# Altium schematic sheet 13-ESP32C6.SchDoc
size B; SheetNumber: 8; SheetTotal: 14
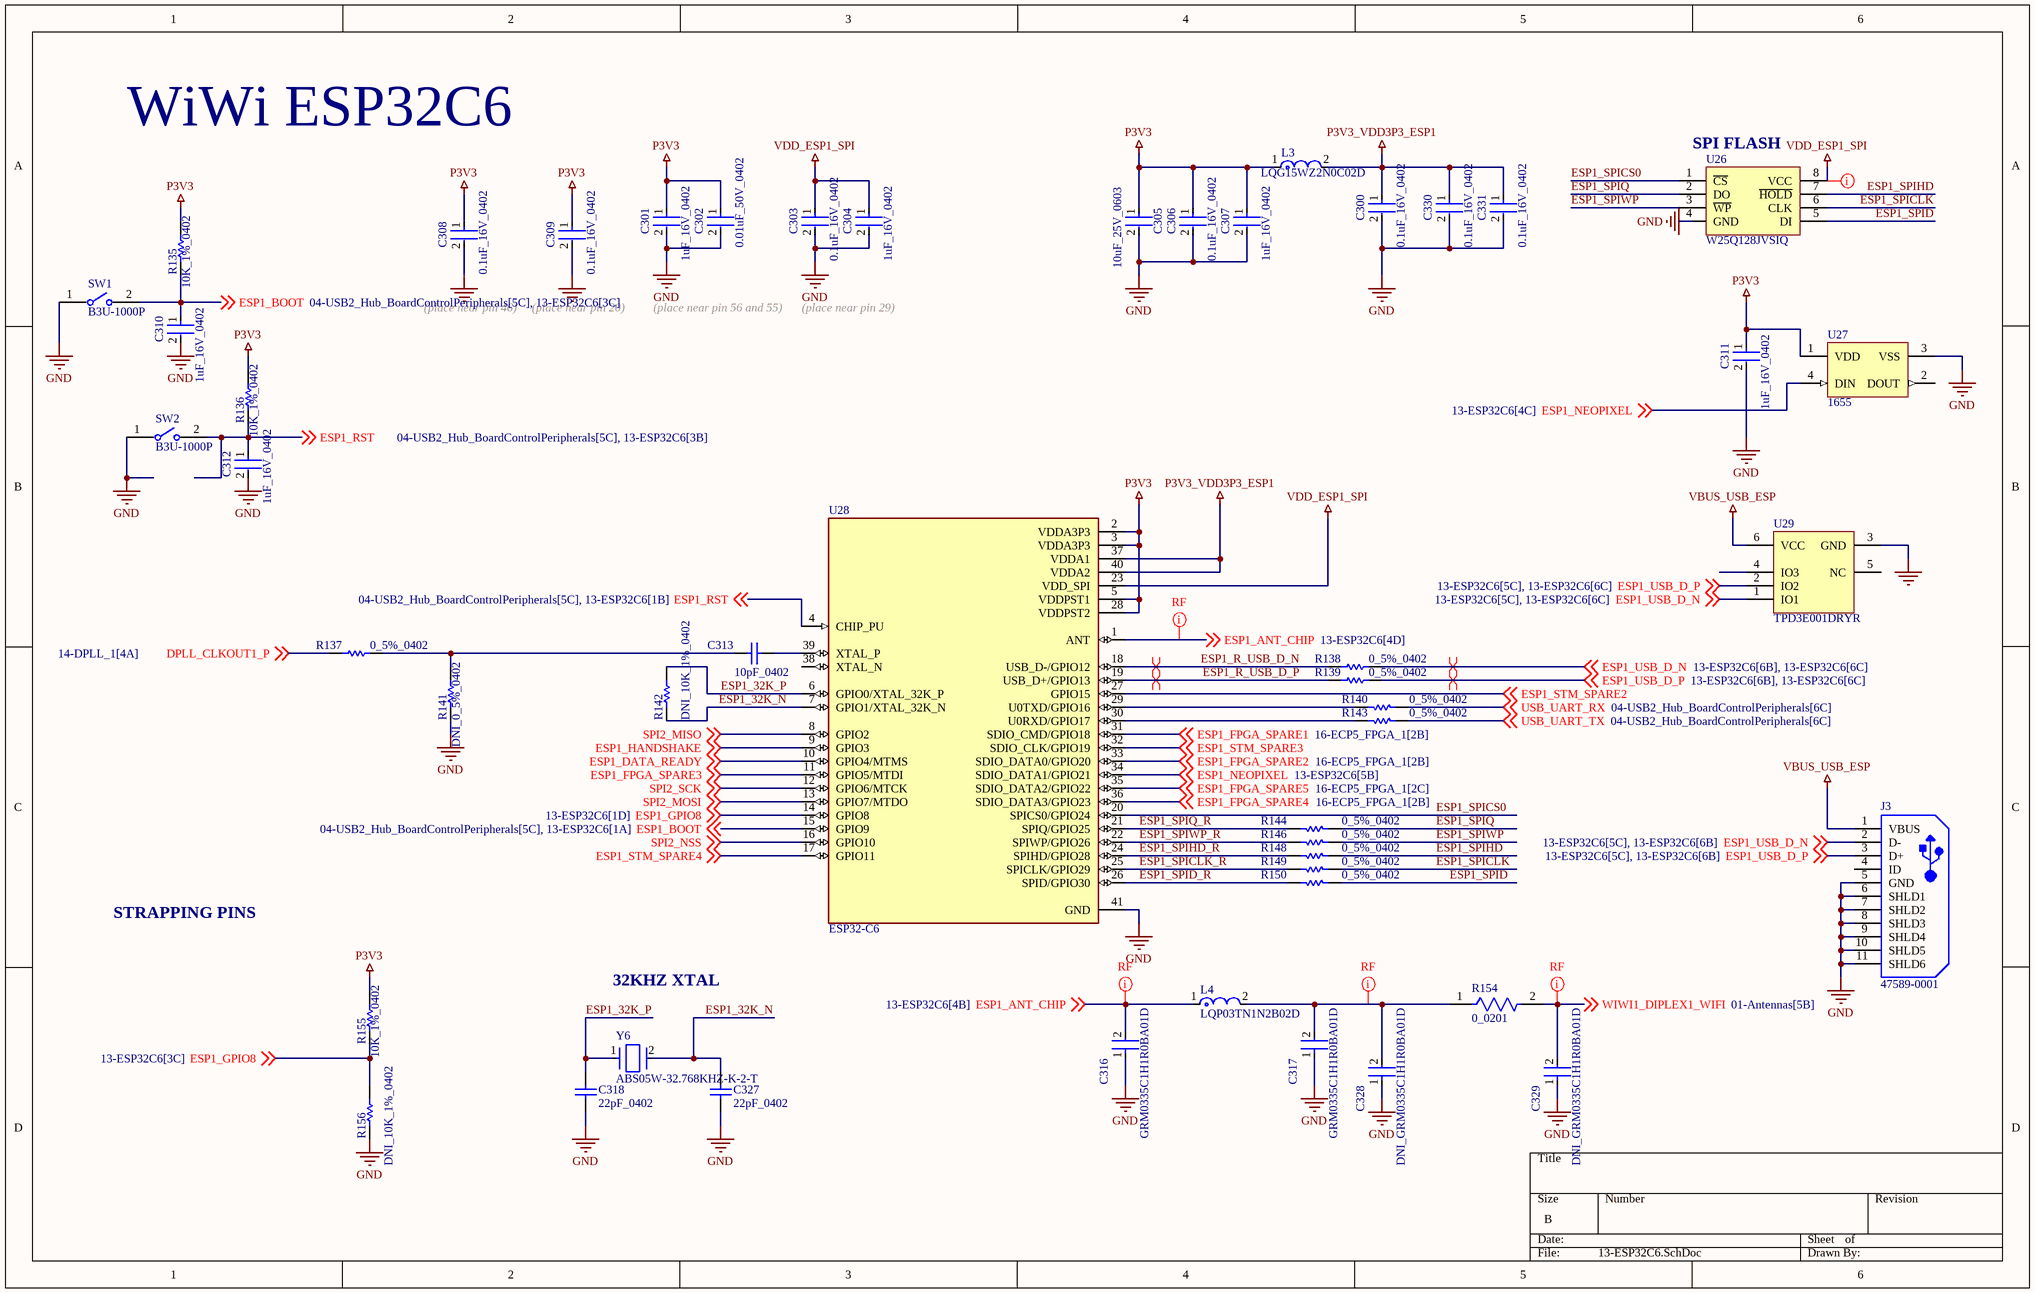
[diagram p0: 13-ESP32C6.SchDoc]

## Parts
C300  0.1uF_16V_0402  [FP-C0402-BB-MFG]
C301  1uF_16V_0402  [FP-0402-L_1_0_0_05-W_0_5-IPC_A]
C302  0.01uF_50V_0402  [FP-GCM155-0_05-IPC_C]
C303  0.1uF_16V_0402  [FP-C0402-BB-MFG]
C304  1uF_16V_0402  [FP-0402-L_1_0_0_05-W_0_5-IPC_A]
C305  10uF_25V_0603  [FP-CL10-IPC_C]
C306  0.1uF_16V_0402  [FP-C0402-BB-MFG]
C307  1uF_16V_0402  [FP-0402-L_1_0_0_05-W_0_5-IPC_A]
C308  0.1uF_16V_0402  [FP-C0402-BB-MFG]
C309  0.1uF_16V_0402  [FP-C0402-BB-MFG]
C310  1uF_16V_0402  [FP-0402-L_1_0_0_05-W_0_5-IPC_A]
C311  1uF_16V_0402  [FP-0402-L_1_0_0_05-W_0_5-IPC_A]
C312  1uF_16V_0402  [FP-0402-L_1_0_0_05-W_0_5-IPC_A]
C313  10pF_0402  [CAPC1005X55X25ML05T05]
C316  GRM0335C1H1R0BA01D  [FP-GRM033-0_03-IPC_C]
C317  GRM0335C1H1R0BA01D  [FP-GRM033-0_03-IPC_C]
C318  22pF_0402  [CAPC1005X55X25ML05T05]
C327  22pF_0402  [CAPC1005X55X25ML05T05]
C328  DNI_GRM0335C1H1R0BA01D  [FP-GRM033-0_03-IPC_C]  (no BOM)
C329  DNI_GRM0335C1H1R0BA01D  [FP-GRM033-0_03-IPC_C]  (no BOM)
C330  0.1uF_16V_0402  [FP-C0402-BB-MFG]
C331  0.1uF_16V_0402  [FP-C0402-BB-MFG]
J3  47589-0001  [MOLX-47589-0001_V]
L3  LQG15WZ2N0C02D  [FP-LQG15WH_02-IPC_B]
L4  LQP03TN1N2B02D  [FP-LQP03TG_02-IPC_A]
R135  10K_1%_0402  [RESC1005X40X25NL10T10]
R136  10K_1%_0402  [RESC1005X40X25NL10T10]
R137  0_5%_0402  [RESC1005X40X25NL05T10]
R138  0_5%_0402  [RESC1005X40X25NL05T10]
R139  0_5%_0402  [RESC1005X40X25NL05T10]
R140  0_5%_0402  [RESC1005X40X25NL05T10]
R141  DNI_0_5%_0402  [RESC1005X40X25NL05T10]  (no BOM)
R142  DNI_10K_1%_0402  [RESC1005X40X25NL10T10]  (no BOM)
R143  0_5%_0402  [RESC1005X40X25NL05T10]
R144  0_5%_0402  [RESC1005X40X25NL05T10]
R146  0_5%_0402  [RESC1005X40X25NL05T10]
R148  0_5%_0402  [RESC1005X40X25NL05T10]
R149  0_5%_0402  [RESC1005X40X25NL05T10]
R150  0_5%_0402  [RESC1005X40X25NL05T10]
R154  0_0201  [FP-RC_L0201-MFG]
R155  10K_1%_0402  [RESC1005X40X25NL10T10]
R156  DNI_10K_1%_0402  [RESC1005X40X25NL10T10]  (no BOM)
SW1  B3U-1000P  [FP-B3U-1000P-MFG]
SW2  B3U-1000P  [FP-B3U-1000P-MFG]
U26  W25Q128JVSIQ  [IC_W25Q128JVSIQ]
U27  1655  [ADA-RGB-1655_V]
U28  ESP32-C6  [QFN40P500X500X90-41N]
U29  TPD3E001DRYR  [DRY0006A]
Y6  ABS05W-32.768KHZ-K-2-T  [FP-ABS05W-MFG]

## Nets
GND: C300.2 C301.2 C302.2 C303.2 C304.2 C305.2 C306.2 C307.2 C308.2 C309.2 C310.2 C311.2 C312.2 C316.1 C317.1 C318.1 C327.1 C328.1 C329.1 C330.2 C331.2 J3.5(GND) J3.6(SHLD1) J3.7(SHLD2) J3.8(SHLD3) J3.9(SHLD4) J3.10(SHLD5) J3.11(SHLD6) R141.1 R156.1 SW1.1 SW2.1 U26.4(GND) U27.3(VSS) U28.41(GND) U29.3(GND)
P3V3: C301.1 C302.1 C305.1 C306.1 C307.1 C308.1 C309.1 C311.1 L3.1 R135.2 R136.2 R155.2 U27.1(VDD) U28.2(VDDA3P3) U28.3(VDDA3P3) U28.5(VDDPST1) U28.28(VDDPST2)
P3V3_VDD3P3_ESP1: C300.1 C330.1 C331.1 L3.2 U28.37(VDDA1) U28.40(VDDA2)
VBUS_USB_ESP: J3.1(VBUS) U29.6(VCC)
VDD_ESP1_SPI: C303.1 C304.1 U26.8(VCC) U28.23(VDD_SPI)
DPLL_CLKOUT1_P: R137.1 ; off-sheet DPLL_CLKOUT1_P
ESP1_32K_N: C327.2 R142.1 U28.7(GPIO1/XTAL_32K_N) Y6.2
ESP1_32K_P: C318.2 R142.2 U28.6(GPIO0/XTAL_32K_P) Y6.1
ESP1_ANT_CHIP: C316.2 L4.1 U28.1(ANT) ; off-sheet ESP1_ANT_CHIP
ESP1_BOOT: C310.1 R135.1 SW1.2 U28.15(GPIO9) ; off-sheet ESP1_BOOT
ESP1_DATA_READY: U28.10(GPIO4/MTMS) ; off-sheet ESP1_DATA_READY
ESP1_FPGA_SPARE1: U28.31(SDIO_CMD/GPIO18) ; off-sheet ESP1_FPGA_SPARE1
ESP1_FPGA_SPARE2: U28.33(SDIO_DATA0/GPIO20) ; off-sheet ESP1_FPGA_SPARE2
ESP1_FPGA_SPARE3: U28.11(GPIO5/MTDI) ; off-sheet ESP1_FPGA_SPARE3
ESP1_FPGA_SPARE4: U28.36(SDIO_DATA3/GPIO23) ; off-sheet ESP1_FPGA_SPARE4
ESP1_FPGA_SPARE5: U28.35(SDIO_DATA2/GPIO22) ; off-sheet ESP1_FPGA_SPARE5
ESP1_GPIO8: R155.1 R156.2 U28.14(GPIO8) ; off-sheet ESP1_GPIO8
ESP1_HANDSHAKE: U28.9(GPIO3) ; off-sheet ESP1_HANDSHAKE
ESP1_NEOPIXEL: U27.4(DIN) U28.34(SDIO_DATA1/GPIO21) ; off-sheet ESP1_NEOPIXEL
ESP1_R_USB_D_N: R138.1 U28.18(USB_D-/GPIO12)
ESP1_R_USB_D_P: R139.1 U28.19(USB_D+/GPIO13)
ESP1_RST: C312.1 R136.1 SW2.2 U28.4(CHIP_PU) ; off-sheet ESP1_RST
ESP1_SPICLK: R149.1 U26.6(CLK)
ESP1_SPICLK_R: R149.2 U28.25(SPICLK/GPIO29)
ESP1_SPICS0: U26.1(~{CS}) U28.20(SPICS0/GPIO24)
ESP1_SPID: R150.1 U26.5(DI)
ESP1_SPID_R: R150.2 U28.26(SPID/GPIO30)
ESP1_SPIHD: R148.1 U26.7(~{HOLD})
ESP1_SPIHD_R: R148.2 U28.24(SPIHD/GPIO28)
ESP1_SPIQ: R144.1 U26.2(DO)
ESP1_SPIQ_R: R144.2 U28.21(SPIQ/GPIO25)
ESP1_SPIWP: R146.1 U26.3(~{WP})
ESP1_SPIWP_R: R146.2 U28.22(SPIWP/GPIO26)
ESP1_STM_SPARE2: U28.27(GPIO15) ; off-sheet ESP1_STM_SPARE2
ESP1_STM_SPARE3: U28.32(SDIO_CLK/GPIO19) ; off-sheet ESP1_STM_SPARE3
ESP1_STM_SPARE4: U28.17(GPIO11) ; off-sheet ESP1_STM_SPARE4
ESP1_USB_D_N: J3.2(D-) R138.2 U29.1(IO1) ; off-sheet ESP1_USB_D_N
ESP1_USB_D_P: J3.3(D+) R139.2 U29.2(IO2) ; off-sheet ESP1_USB_D_P
SPI2_MISO: U28.8(GPIO2) ; off-sheet SPI2_MISO
SPI2_MOSI: U28.13(GPIO7/MTDO) ; off-sheet SPI2_MOSI
SPI2_NSS: U28.16(GPIO10) ; off-sheet SPI2_NSS
SPI2_SCK: U28.12(GPIO6/MTCK) ; off-sheet SPI2_SCK
USB_UART_RX: R140.1 ; off-sheet USB_UART_RX
USB_UART_TX: R143.1 ; off-sheet USB_UART_TX
WIWI1_DIPLEX1_WIFI: C329.2 R154.2 ; off-sheet WIWI1_DIPLEX1_WIFI
NetC313_1: C313.1 R137.2 R141.2
NetC313_2: C313.2 U28.39(XTAL_P)
NetC317_2: C317.2 C328.2 L4.2 R154.1
NetR140_2: R140.2 U28.29(U0TXD/GPIO16)
NetR143_2: R143.2 U28.30(U0RXD/GPIO17)

Not connected (* = marked no-connect by the designer): J3 4(ID); U27 2(DOUT); U28 38(XTAL_N); U29 4(IO3) 5(NC)

## Layout directives
net class Power: VDD_ESP1_SPI
net class RF: ESP1_ANT_CHIP, NetC317_2, WIWI1_DIPLEX1_WIFI
differential pair: ESP1_R_USB_D_N, ESP1_R_USB_D_P, ESP1_USB_D_N, ESP1_USB_D_P

## Notes on the sheet
- WiWi ESP32C6
- (near U26) SPI FLASH
- (place near pin 46)
- (place near pin 20)
- (place near pin 56 and 55)
- (place near pin 29)
- STRAPPING PINS
- 32KHZ XTAL

## Library data of the parts
C300 C303 C306 C308 C309 C330 C331 = CMP-1034-02068-3: CAP CER 0.1UF 16V 5% X7R 0402; Manufacturer: Kemet; Manufacturer Part Number: C0402C104J4RACTU; Value: 0.10 μF; Temperature Coefficient: 15%; Tolerance: 0.05; Material: Ceramic; ComponentLink2URL: https://content.kemet.com/datasheets/KEM_C1002_X7R_SMD.pdf; Automotive: No; Device Class L2: Capacitors; Temperature: -55°C to +125°C; RoHS: TRUE; Voltage Rating: 16 V; ComponentLink2Description: Datasheet; Device Class L3: Ceramic Capacitors; Temperature Range Low: -55°C; Ipc Land Pattern Name: CAPC10050X50; Device Class L1: Passive Components; Temperature Range High: +125°C; Package: C0402-BB; Capacitance: 0.10 μF; Category: Cap; Mouser Description: CAP CER 0.1UF 16V X7R 0402; Height: 0.55mm; Digikey Description: CAP CER 0.1UF 16V 5% X7R 0402; Octopart: https://octopart.com/c0402c104j4ractu-kemet-12573893; Temperature Characteristic: X7R; Lead Free: Yes
C301 C304 C307 C310-C312 = CMP-14477-000104-2: None; Tolerance: 10%; Voltage Rating: 16V; Dielectric: X5R; Capacitance: 1uF; Packaging: Tape and Reel; Depth: 0.5mm; Mount: Surface Mount; Thickness: 0.022inch; Package Quantity: 1; Min Operating Temperature: -55°C; Series: M; Voltage Rating (DC): 16V; Termination: SMD/SMT; Case/Package: 0402; Number of Pins: 2; Case Code (Imperial): 0402; Length: 1mm; Halogen Free: Halogen Free; Case Code (Metric): 1005; Width: 0.02inch; RoHS Compliant: Yes; Radiation Hardening: No; Max Operating Temperature: 85°C; Height: 0.5mm; Construction: Flat
C302 = CMP-2008-03723-3: Ceramic Capacitor for Automotive 10nF ±10% 50VDC X7R 0402 Paper T/R; Voltage Rating (DC): 50V; Min Operating Temperature: -55°C; Radiation Hardening: No; Mount: Surface Mount; Thickness: 0.022inch; Package Quantity: 1; Case Code (Imperial): 0402; Lead Free: Lead Free; Case/Package: 0402; Depth: 0.5mm; Termination: SMD/SMT; Tolerance: 10%; Voltage: 50V; Packaging: Tape and Reel; Width: 0.02inch; REACH SVHC: No SVHC; Height: 0.5mm; Max Operating Temperature: 125°C; Case Code (Metric): 1005; Voltage Rating: 50V; Capacitance: 10nF; Ratings: AEC-Q200; Length: 1mm; Dielectric: X7R
C305 = CMP-13271-004224-1: Cap Ceramic 10uF 25V X5R ±20% Pad SMD 0603 +85°C T/R; Width: 0.031inch; Voltage Rating: 25V; Length: 0.063inch; Case Code (Metric): 1608; Dielectric: X5R; Termination: Wraparound; Capacitance: 10uF; Lead Free: Lead Free; Mount: Surface Mount; Package Quantity: 1; Case Code (Imperial): 0603; Thickness: 0.035inch; Packaging: Tape and Reel; Contact Plating: Tin; Min Operating Temperature: -55°C; Tolerance: 20%; Max Operating Temperature: 85°C; Case/Package: 0603
C313 = CMP-2100-03589-1: Chip Capacitor, 10 pF, +/- 5%, 50 V, -55 to 125 degC, 0402 (1005 Metric), RoHS, Tape and Reel; Manufacturer: Yageo; Insulation Resistance: 100GR; Voltage Rating (DC): 50V; Dielectric Material: Ceramic; Temperature Coefficient: 30ppm/degC; Dielectric: C0G; Capacitance: 10pF; Termination: SMD/SMT; Package Reference: 0402; Lead Free: LeadFree; Composition: Ceramic; Tolerance: 5%; Case Code (Metric): 1005; Voltage Rating: 50V; Packaging: TapeandReel; Manufacturer URL: http://www.yageo.com/; REACH SVHC: NoSVHC; Max Operating Temperature: 125degC; Length: 1mm; Mount: SurfaceMount; Depth: 0.5mm; Min Operating Temperature: -55degC; Number of Pins: 2; Width: 0.02inch; Datasheet Version: Rev. 14, 07/2016; Package Quantity: 1; Datasheet URL: http://www.yageo.com/documents/recent/UPY-GP_NP0_16V-to-50V_14.pdf; Case Code (Imperial): 0402; RoHSCompliant: True; Radiation Hardening: No; Height: 0.5mm; Case/Package: 0402; Thickness: 0.022inch; Package Description: 2-Pin Surface Mount Device, Body 1 x 0.5 mm; Voltage: 50V
C316 C317 C328 C329 = CMP-2010-01509-2: Chip Multilayer Ceramic Capacitors for General Purpose, 0201, 1.0pF, C0G, 30ppm/°C, 0.1pF, 50V; Capacitance: 1pF; Termination: SMD/SMT; Depth: 0.3mm; Mount: Surface Mount; Case Code (Metric): 0603; Length: 0.024inch; Voltage Rating: 50V; Voltage Rating (DC): 50V; Width: 0.012inch; Lead Free: Lead Free; Dielectric: C0G; Thickness: 0.013inch; Packaging: Tape and Reel; Case Code (Imperial): 0201; Case/Package: 0201; Package Quantity: 15000; Min Operating Temperature: -55°C; Max Operating Temperature: 125°C
C318 C327 = CMP-2100-03590-1: Chip Capacitor, 22 pF, +/- 5%, 50 V, -55 to 125 degC, 0402 (1005 Metric), RoHS, Tape and Reel; Manufacturer: Yageo; Voltage Rating: 50V; Dielectric Material: Ceramic; Capacitance: 22pF; Temperature Coefficient: 30ppm/degC; Dielectric: C0G; Insulation Resistance: 100GR; Datasheet URL: http://www.yageo.com/NewPortal/yageodocoutput?fileName=/pdf/MLCC/UPY-GP_NP0_16V-to-50V_14.pdf; Depth: 0.5mm; Number of Pins: 2; Height: 0.5mm; Min Operating Temperature: -55degC; REACH SVHC: NoSVHC; Max Operating Temperature: 125degC; Voltage Rating (DC): 50V; Composition: Ceramic; Packaging: TapeandReel; Package Quantity: 1; Package Reference: 0402; Length: 1mm; Radiation Hardening: No; Package Description: 2-Pin Surface Mount Device, Body 1 x 0.5 mm; RoHSCompliant: True; Thickness: 0.022inch; Manufacturer URL: http://www.yageo.com/; Mount: SurfaceMount; Case Code (Metric): 1005; Case/Package: 0402; Tolerance: 5%; Termination: SMD/SMT; Width: 0.02inch; Datasheet Version: Rev. 14, 07/2016; Lead Free: LeadFree; Case Code (Imperial): 0402
J3 = CMP-2000-05610-1: Right Angle Female Type AB Micro USB Connector, 30 V, 1.8 A, -30 to 85 degC, RoHS, Tape and Reel; Number of Ports: 1Port; Current Rating: 1.8A; Brand: Molex; Connector Type: MicroUSBTypeABreceptacle; Number of Contacts: 5Contact; Voltage Rating: 30VAC; Color: Black; Product: MicroUSBTypeABConnectors; Package URL: http://www.molex.com/pdm_docs/sd/475890001_sd.pdf; Contact Plating: Gold; Datasheet URL: http://www.molex.com/webdocs/datasheets/pdf/en-us/0475890001_IO_CONNECTORS.pdf; Operating Temperature Range: -20Cto+85C; Termination Style: SMD/SMT; Mounting Angle: Right; Package Reference: 47589-0001; Gender: Female; Package Description: Micro USB Connector, Pitch 0.65 mm, 5 Positions, Body 7.5 x 5.6 mm; Mounting Technology: SurfaceMount; Contact Material: CopperAlloy; Packaging: Reel; RoHS: True; Standard: USB; Manufacturer URL: http://www.molex.com/; Manufacturer: Molex; Datasheet Version: 12/2016; Product Category: USBConnectors; Series: 47589
L3 = CMP-06042-012509-1: Multilayer type Inductor for Automotive 2nH ±0.2nH 0.05Ω 1000mA 0402; Test Frequency: 100MHz; Shielding: Unshielded; DC Resistance (DCR): 50mR; Self Resonant Frequency: 8GHz; Current Rating: 1A; Core Material: Air; Case Code (Metric): 1005; Case/Package: 0402; Mount: Surface Mount; Min Operating Temperature: -55°C; Inductance: 2nH; Ratings: AEC-Q200; Max Operating Temperature: 125°C; Packaging: Cut Tape; Case Code (Imperial): 0402
L4 = CMP-06042-001577-1: Film type RF Inductor 1.2nH ±0.1nH 750mA 0.1Ω 0201 (0603); DC Resistance (DCR): 100mR; Current: 600mA; Core Material: Non-Magnetic; Shielding: Unshielded; Q Factor: 14; Test Frequency: 500MHz; Self Resonant Frequency: 6GHz; Inductance: 1.2nH; Mount: Surface Mount; Package Quantity: 15000; Length: 0.024inch; Resistor Type: Thin Film; Min Operating Temperature: -55°C; Depth: 0.33mm; Height: 0.012inch; Max DC Current: 750mA; Width: 0.012inch; Case/Package: 0201; Case Code (Imperial): 0201; Lead Free: Lead Free; Military Standard: Not; Termination: SMD/SMT; Max Operating Temperature: 125°C; DC Current: 750mA; Packaging: Tape and Reel; Case Code (Metric): 0603; Height - Seated (Max): 0.013inch; REACH SVHC: No SVHC; Radiation Hardening: No; Current Rating: 750mA
R135 R136 R142 R155 R156 = CMP-2002-04694-1: Manufacturer: Bourns; Part Number: CR0402-FX-1002GLF
R137-R141 R143 R144 R146 R148-R150 = CMP-2002-06457-1: Manufacturer: Panasonic; Part Number: ERJ-U020R00X
R154 = CMP-03412-023265-1: RES SMD 0 OHM JUMPER 1/20W 0201; Manufacturer: Yageo; Manufacturer Part Number: RC0201JR-070RL; Power Rating: 50mW; Value: 0Ω; Temperature Coefficient: 200ppm/°C; Voltage Rating: 25V; Tolerance: 5%; Octopart: https://octopart.com/rc0201jr-070rl-yageo-43171986; ComponentLink2URL: http://www.yageo.com/documents/recent/PYu-RC_Group_51_RoHS_L_10.pdf; Device Class L2: Resistors; Series: RC_L; Ipc Land Pattern Name: RESC6030X23; Temperature: -55°C to +125°C; Mouser Description: Thick Film Resistors ZERO OHM JUMPER; Footprint Url: http://www.yageo.com/exep/pages/download/literatures/PYu-R_Mount_10.pdf; RoHS: TRUE; Package: RC_L0201; Device Class L3: Chip SMD Resistors; Temperature Range Low: -55°C; Composition: Thick Film; ComponentLink2Description: Datasheet; Height: 0.26mm; Device Class L1: Passive Components; Category: Res; Resistance: 0Ω; Temperature Range High: +125°C; Automotive: No; Lead Free: Yes; Digikey Description: RES SMD 0 OHM JUMPER 1/20W 0201
SW1 SW2 = CMP-2100-03586-2: SWITCH TACTILE SPST-NO 0.05A 12V; Contact Resistance: 100mR; Operating Force: 1.5N; Max Current Rating: 50mA; Switch Travel: 0.15mm; Actuator Type: Standard; Mechanical Life: 200000Cycles; Ratings: Dust Proof; Illumination Type: Non-Illuminated; Throw Configuration: SPST; Actuator Length: 0.4mm; Switch Function: Off-Mom; Height: 1.2mm; Width: 3mm; Weight: 0.000776oz; Contact Material: Silver; Max Voltage Rating (DC): 12V; Insulation Resistance: 100MR; Lead Free: Lead Free; Current Rating: 50mA; Termination: SMD/SMT; Length: 4mm; Voltage Rating (DC): 12V; Contact Current Rating: 50mA; Orientation: Straight; Depth: 2.5mm; Max Operating Temperature: 70°C; Packaging: Tape and Reel; Min Operating Temperature: -25°C; Package Quantity: 1; Mount: Surface Mount; Electrical Life: 200000Cycles
U26 = IC_W25Q128JVSIQ: NOR Flash Serial (SPI, Dual SPI, Quad SPI) 3.3V 128M-bit 16M x 8 6ns 8-Pin SOIC Tube; Manufacturer: Winbond; Memory Format: Non-Volatile,FLASH; Frequency: 133MHz; Memory Size: 128Mb; Supplier 1: Digi-Key; Manufacturer Part Number: W25Q128JVSIQ; RoHS: Yes; Category: Flash; Stock 1: 154352; Pricing 1: 1=1.71, 10=1.562, 25=1.52, 50=1.5124, 100=1.3519, 250=1.348, 500=1.32762, 1000=1.27127, 5000=1.18359 (USD); Mounting Technology: Surface Mount; Case/Package: SOIC; Min Operating Temperature: -40°C; Max Operating Temperature: 85°C; Packaging: Tray; Series: SpiFlash®; RoHS Compliant: Yes; ComponentLink1URL: http://www.winbond.com/resource-files/w25q128jv%20revf%2003272018%20plus.pdf?src-supplier=Digi-Key; ComponentLink1Description: http://www.winbond.com/resource-files/w25q128jv%20revf%2003272018%20plus.pdf?src-supplier=Digi-Key; Supplier Part Number 1: W25Q128JVSIQ-ND
U27 = CMP-2000-05026-1: Intelligent Control LED Integrated Light Source, 3.5 to 5.3 V, -25 to 80 degC, 4-Pin SMD, RoHS, Tape and Reel; Manufacturer: Adafruit-Industries-LLC; Number of LEDs: 10; Configuration: Discrete; Utilized LED: WS2812(5050); Datasheet URL: http://datasheet.octopart.com/ADA1655-Adafruit-Industries-datasheet-32028139.pdf; Series: Neopixel; Interface: -; Package Description: 4-Pin Surface Mount Device, Body 5 x 5 mm; Color: Red,Green,Blue(RGB); Category: Optoelectronics; Controller Type: -; Package Reference: 1655; Manufacturer URL: https://www.adafruit.com/; Mounting Type: SurfaceMount; Datasheet Version: May-13; Size / Dimension: 5.00mmLx5.00mmW; Family: Addressable,Specialty
U28 = ESP32-C6: IC RF TxRx Only Bluetooth, WiFi Bluetooth v5.0, Thread, ZigbeeÂ® 2.412GHz ~ 2.484GHz 40-VFQFN Exposed Pad; MF: Espressif Systems; SnapEDA_Link: https://www.snapeda.com/parts/ESP32-C6/Espressif+Systems/view-part/?ref=snap; Package: None; Value: *; MP: ESP32-C6; Check_prices: https://www.snapeda.com/parts/ESP32-C6/Espressif+Systems/view-part/?ref=eda
U29 = CMP-0326-00032-3: Low-Capacitance + / - 15 kV ESD-Protection Array for High-Speed Data Interfaces, 3 Channels, -40 to +85 degC, 6-pin SON (DRY), Green (RoHS & no Sb/Br); Manufacturer: Texas Instruments; USB High Speed: TRUE; SubFamily: ESD Solution; IO Capacitance(Typ)(pF): 1.5; IEC 61000-4-2 Contact(+/- kV): 8; IO Leakage Current(nA): Jan-00; Breakdown Voltage(Min)(V): 11; IEC 61000-4-2 Air-Gap(+/- kV): 15; DatasheetVersion: SLLS683D; Mounting Technology: Surface Mount; ComponentLink1URL: http://www.ti.com/; PackageReference: DRY0006A; ComponentLink2URL: http://www.ti.com/general/docs/lit/getliterature.tsp?genericPartNumber=TPD3E001&fileType=pdf; ComponentLink2Description: Datasheet; ComponentLink3Description: URL Link1; PackageDescription: 6-Pin Plastic Small Outline No-Lead, 1 x 1.45 x 0.6 mm Body, 0.5 mm Pitch; ComponentLink1Description: Manufacturer URL; PackageVersion: revF, Dec-2011; PartNumber: TPD3E001DRYR; Eco-Plan: Green (RoHS & no Sb/Br); ComponentLink3URL: SamplesURL:http://www.ti.com/product/tpd3e001#samples
Y6 = CMP-27762-015607-1: Crystal 32.768kHz ±20ppm (Tol) 4pF 85kΩ 2-Pin SMD T/R; ESR (Equivalent Series Resistance): 85kR; Frequency Tolerance: 20ppm; Mount: Surface Mount; Load Capacitance: 4pF; Case/Package: SMD/SMT; Packaging: Cut Tape; Frequency: 32.768kHz; Series: ABS05W; Min Operating Temperature: -40°C; Max Operating Temperature: 125°C